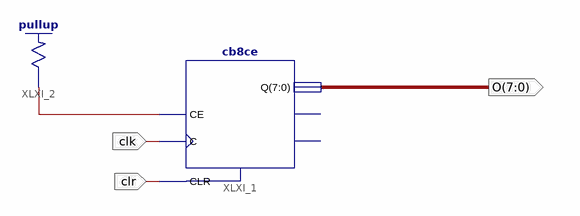
[diagram p0: schematic sheet 1]
// Xilinx ISE schematic EightBitCounter.sch (spartan6) as structural Verilog: 2 symbols, 3 ports
module EightBitCounter (
  input  clk,
  input  clr,
  output [7:0] O
);

  wire XLXN_1;

  cb8ce XLXI_1 (.C(clk), .CE(XLXN_1), .CLR(clr), .Q(O));  // open: CEO, TC
  \pullup  XLXI_2 (.O(XLXN_1));
endmodule
